# Altium schematic sheet S7CAS-PLEIADES-CARTE-MERE_P07_USB.SchDoc
size Tabloid; DocumentNumber: 12; SheetNumber: 12; SheetTotal: 16; Sheet_Name: USB; Size: 11x17
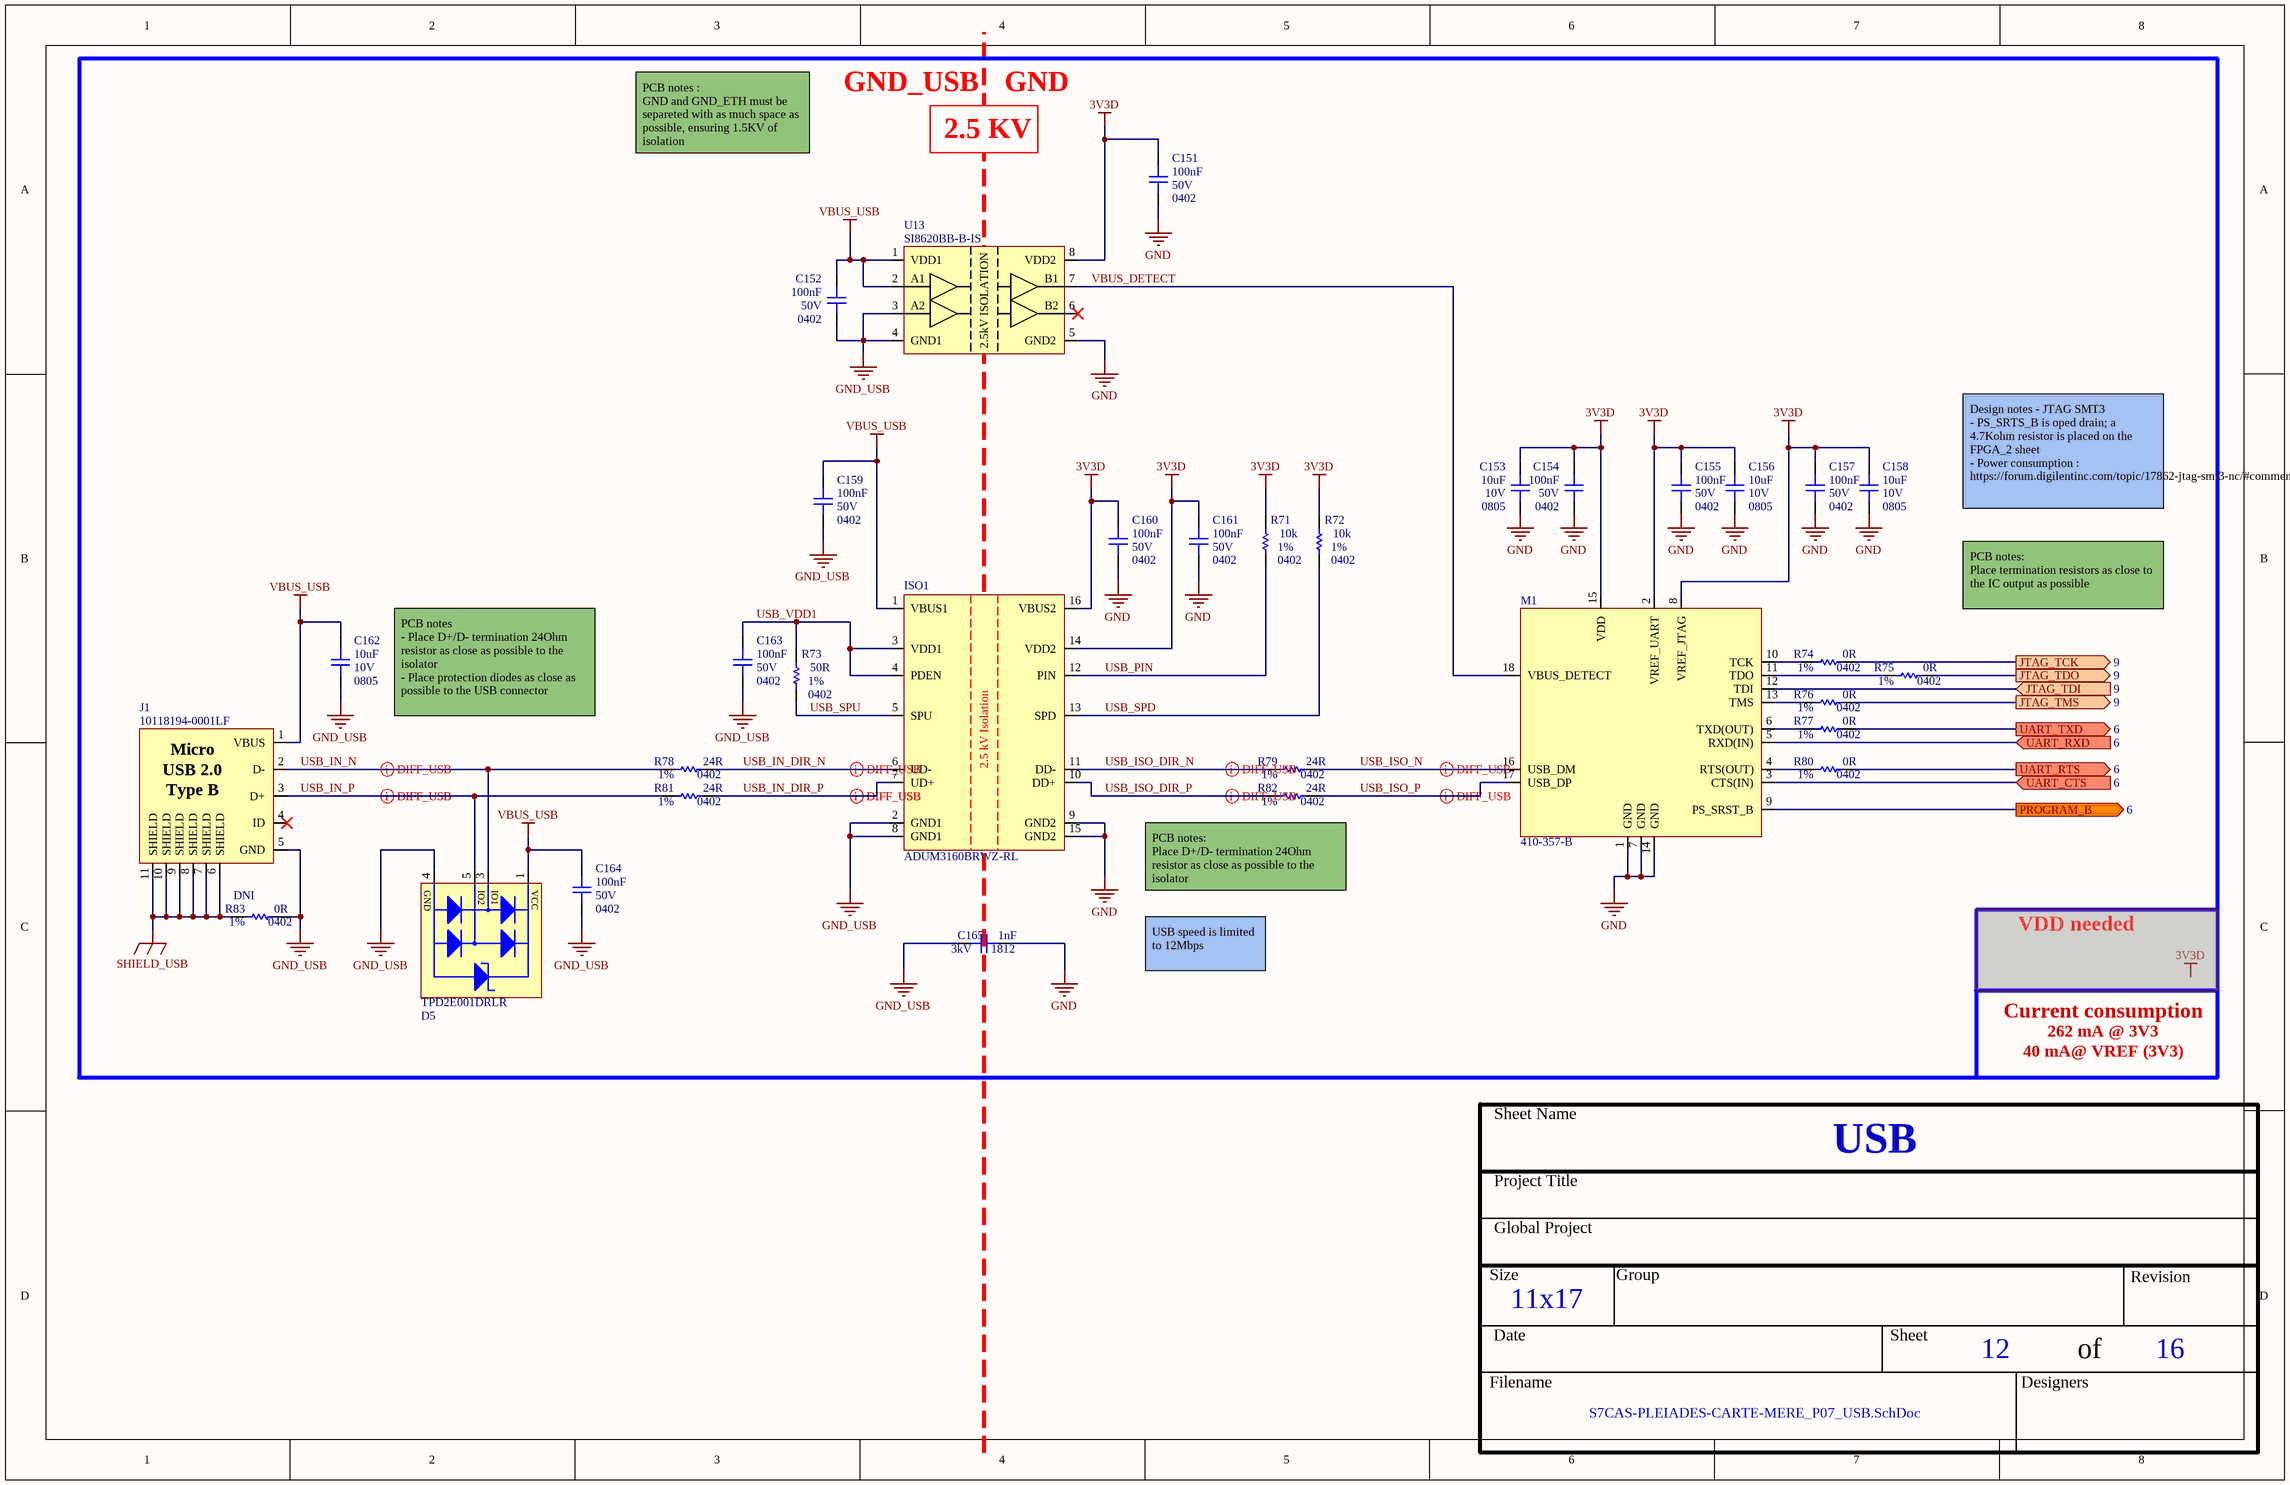
[diagram p0: S7CAS-PLEIADES-CARTE-MERE_P07_USB.SchDoc]

## Parts
C151  value 100nF  Voltage: 50V  Package: 0402  [CAP_0402]  (hidden comment: CAP - 0402)
C152  value 100nF  Voltage: 50V  Package: 0402  [CAP_0402]  (hidden comment: CAP - 0402)
C153  value 10uF  Voltage: 10V  Package: 0805  [CAP_0805]  (hidden comment: CAP - 0805)
C154  value 100nF  Voltage: 50V  Package: 0402  [CAP_0402]  (hidden comment: CAP - 0402)
C155  value 100nF  Voltage: 50V  Package: 0402  [CAP_0402]  (hidden comment: CAP - 0402)
C156  value 10uF  Voltage: 10V  Package: 0805  [CAP_0805]  (hidden comment: CAP - 0805)
C157  value 100nF  Voltage: 50V  Package: 0402  [CAP_0402]  (hidden comment: CAP - 0402)
C158  value 10uF  Voltage: 10V  Package: 0805  [CAP_0805]  (hidden comment: CAP - 0805)
C159  value 100nF  Voltage: 50V  Package: 0402  [CAP_0402]  (hidden comment: CAP - 0402)
C160  value 100nF  Voltage: 50V  Package: 0402  [CAP_0402]  (hidden comment: CAP - 0402)
C161  value 100nF  Voltage: 50V  Package: 0402  [CAP_0402]  (hidden comment: CAP - 0402)
C162  value 10uF  Voltage: 10V  Package: 0805  [CAP_0805]  (hidden comment: CAP - 0805)
C163  value 100nF  Voltage: 50V  Package: 0402  [CAP_0402]  (hidden comment: CAP - 0402)
C164  value 100nF  Voltage: 50V  Package: 0402  [CAP_0402]  (hidden comment: CAP - 0402)
C165  value 1nF  Voltage: 3kV  Package: 1812  [CAP_1812]  (hidden comment: CAP - 1812)
D5  TPD2E001DRLR  [TVS_USB_TPD2E001DRLR]
ISO1  ADUM3160BRWZ-RL  [ISO_ADUM3160BRWZ-RL]
J1  10118194-0001LF  [CON_USB_10118194-0001LF]
M1  410-357-B  [MOD_JTAG_410-357-B]
R71  value 10k  Package: 0402  Precision: 1%  [RES_0402]  (hidden comment: RES - 0402)
R72  value 10k  Package: 0402  Precision: 1%  [RES_0402]  (hidden comment: RES - 0402)
R73  value 50R  Package: 0402  Precision: 1%  [RES_0402]  (hidden comment: RES - 0402)
R74  value 0R  Package: 0402  Precision: 1%  [RES_0402]  (hidden comment: RES - 0402)
R75  value 0R  Package: 0402  Precision: 1%  [RES_0402]  (hidden comment: RES - 0402)
R76  value 0R  Package: 0402  Precision: 1%  [RES_0402]  (hidden comment: RES - 0402)
R77  value 0R  Package: 0402  Precision: 1%  [RES_0402]  (hidden comment: RES - 0402)
R78  value 24R  Package: 0402  Precision: 1%  [RES_0402]  (hidden comment: RES - 0402)
R79  value 24R  Package: 0402  Precision: 1%  [RES_0402]  (hidden comment: RES - 0402)
R80  value 0R  Package: 0402  Precision: 1%  [RES_0402]  (hidden comment: RES - 0402)
R81  value 24R  Package: 0402  Precision: 1%  [RES_0402]  (hidden comment: RES - 0402)
R82  value 24R  Package: 0402  Precision: 1%  [RES_0402]  (hidden comment: RES - 0402)
R83  value 0R  Package: 0402  Precision: 1%  Assembly note: DNI  [RES_0402]  (hidden comment: RES - 0402)
U13  SI8620BB-B-IS  [ISO_SI8620BB-B-IS]

## Ports
JTAG_TCK (out, see 9), JTAG_TDI (in, see 9), JTAG_TDO (out, see 9), JTAG_TMS (out, see 9), PROGRAM_B (out, see 6), UART_CTS (in, see 6), UART_RTS (out, see 6), UART_RXD (in, see 6), UART_TXD (out, see 6)

## Nets
3V3D: C151.2 C153.2 C154.2 C155.2 C156.2 C157.2 C158.2 C160.2 C161.2 ISO1.14(VDD2) ISO1.16(VBUS2) M1.2(VREF_UART) M1.8(VREF_JTAG) M1.15(VDD) R71.2 R72.2 U13.8(VDD2)
GND: C151.1 C153.1 C154.1 C155.1 C156.1 C157.1 C158.1 C160.1 C161.1 C165.1 ISO1.9(GND2) ISO1.15(GND2) M1.1(GND) M1.7(GND) M1.14(GND) U13.5(GND2)
GND_USB: C152.1 C159.1 C162.1 C163.1 C164.1 C165.2 D5.4(GND) ISO1.2(GND1) ISO1.8(GND1) J1.5(GND) R83.1 U13.3(A2) U13.4(GND1)
SHIELD_USB: J1.6(SHIELD) J1.7(SHIELD) J1.8(SHIELD) J1.9(SHIELD) J1.10(SHIELD) J1.11(SHIELD) R83.2
VBUS_USB: C152.2 C159.2 C162.2 C164.2 D5.1(VCC) ISO1.1(VBUS1) J1.1(VBUS) U13.1(VDD1) U13.2(A1)
JTAG_TCK: R74.1 ; port JTAG_TCK
JTAG_TDI: M1.12(TDI) ; port JTAG_TDI
JTAG_TDO: R75.1 ; port JTAG_TDO
JTAG_TMS: R76.1 ; port JTAG_TMS
PROGRAM_B: M1.9(PS_SRST_B) ; port PROGRAM_B
UART_CTS: M1.3(CTS(IN)) ; port UART_CTS
UART_RTS: R80.1 ; port UART_RTS
UART_RXD: M1.5(RXD(IN)) ; port UART_RXD
UART_TXD: R77.1 ; port UART_TXD
USB_IN_DIR_N: ISO1.6(UD-) R78.1
USB_IN_DIR_P: ISO1.7(UD+) R81.1
USB_IN_N: D5.3(IO1) J1.2(D-) R78.2
USB_IN_P: D5.5(IO2) J1.3(D+) R81.2
USB_ISO_DIR_N: ISO1.11(DD-) R79.2
USB_ISO_DIR_P: ISO1.10(DD+) R82.2
USB_ISO_N: M1.16(USB_DM) R79.1
USB_ISO_P: M1.17(USB_DP) R82.1
USB_PIN: ISO1.12(PIN) R71.1
USB_SPD: ISO1.13(SPD) R72.1
USB_SPU: ISO1.5(SPU) R73.1
USB_VDD1: C163.2 ISO1.3(VDD1) ISO1.4(PDEN) R73.2
VBUS_DETECT: M1.18(VBUS_DETECT) U13.7(B1)
NetM1_4: M1.4(RTS(OUT)) R80.2
NetM1_6: M1.6(TXD(OUT)) R77.2
NetM1_10: M1.10(TCK) R74.2
NetM1_11: M1.11(TDO) R75.2
NetM1_13: M1.13(TMS) R76.2

Not connected (* = marked no-connect by the designer): D5 2(NC); J1 4(ID)*; U13 6(B2)*

## Layout directives
differential pair; differential pair class DIFF_90OHM: USB_IN_DIR_N, USB_IN_DIR_P, USB_IN_N, USB_IN_P, USB_ISO_DIR_N, USB_ISO_DIR_P, USB_ISO_N, USB_ISO_P

## Notes on the sheet
- GND_USB
- GND
- PCB notes :
  GND and GND_ETH must be separeted with as much space as possible, ensuring 1.5KV of isolation
- 2.5 KV
- Design notes - JTAG SMT3
  - PS_SRTS_B is oped drain; a 4.7Kohm resistor is placed on the FPGA_2 sheet
  - Power consumption : https://forum.digilentinc.com/topic/17862-jtag-smt3-nc/#comment-45773
- PCB notes:
  Place termination resistors as close to the IC output as possible
- PCB notes
  - Place D+/D- termination 24Ohm resistor as close as possible to the isolator
  - Place protection diodes as close as possible to the USB connector
- (near R82) PCB notes:
  Place D+/D- termination 24Ohm resistor as close as possible to the isolator
- USB speed is limited to 12Mbps
- VDD needed
- 262 mA @ 3V3
- Current consumption
- 40 mA@ VREF (3V3)
- Sheet Name
- Project Title
- Global Project
- Size
- Group
- Revision
- Date
- Sheet
- of
- Filename
- Designers
- (in symbol CON_USB_10118194-0001LF) Micro; USB 2.0; Type B
- (in symbol ISO_ADUM3160BRWZ-RL) 2.5 kV Isolation
- (in symbol ISO_SI8620BB-B-IS) 2.5kV ISOLATION

## Library data of the parts
C151 C152 C154 C155 C157 C159-C161 C163 C164 = CAP - 0402: Precision: 10%; Current: *; CreatedBy: Jonathan Bouchard; Power: *
C153 C156 C158 C162 = CAP - 0805: Mfg: CL21B106KPQNNNE; Precision: 10%; Current: *; CreatedBy: Jonathan Bouchard; Power: *
C165 = CAP - 1812: Mfg Part Number: 1812HC102MAT1A; Precision: 10%; Current: *; CreatedBy: Jonathan Bouchard; Power: *
D5 = TVS_USB_TPD2E001DRLR: TVS - USB TVS DIODE 5.5V - SOT-553; Manufacturer #1: Texas Instruments; Value: 11V Breakdown; Voltage Rating: 5.5V (Max); GRAMS Lib Spec: 2.8; Magnetic Material: YES; Cryo: UNKNOWN; Tolerance: *; Current Rating: *; Power Max: *; HelpURL: http://www.ti.com/lit/ds/symlink/tpd2e001.pdf; CreatedBy/Date: Jonathan Bouchard 2018-07-10; VerifiedBy: Arnaud Samson 16-07-18; Temperature: -40°C ~ 85°C (TA); Package: SOT-553; Manufacturer #2: *; Note: *; Assembly Type: SMD; Part Number #2: *; Part Number #1: TPD2E001DRLR; Polarized: YES; Supplier 1: Digi-Key; Supplier Part Number 1: 296-21883-1-ND
ISO1 = ISO_ADUM3160BRWZ-RL: ISO - DGTL ISO 2.5KV 2CH USB - 16SOIC; Manufacturer #1: Analog Devices; Value: 2500Vrms voltage isolation; Voltage Rating: 3~5.5V; GRAMS Lib Spec: 2.8; Magnetic Material: UNKNOWN; Polarized: Yes; Tolerance: *; Current Rating: *; Power Max: *; HelpURL: https://www.analog.com/media/en/technical-documentation/data-sheets/ADuM3160.pdf; CreatedBy/Date: Tommy Rossignol 2018-11-16; VerifiedBy: Caroline Paulin - 13 février 2019; Temperature: -40°C ~ 105°C; Package: 16-SOIC; Manufacturer #2: *; Assembly Type: SMD; Part Number #2: *; Part Number #1: ADUM3160BRWZ-RL; Supplier 1: Digi-Key; Supplier Part Number 1: ADUM3160BRWZ-RLCT-ND; Cryo: UNKNOWN
J1 = CON_USB_10118194-0001LF: CON - USB MICRO B RECPT SMT R/A - 4PIN; Manufacturer #1: Amphenol FCI; Value: USB - Micro B; Voltage Rating: 100VAC; Current Rating: 1.8A; GRAMS Lib Spec: 2.8; Magnetic Material: YES; Cryo: UNKNOWN; Tolerance: *; Power Max: *; HelpURL: https://cdn.amphenol-icc.com/media/wysiwyg/files/drawing/10118194.pdf; CreatedBy/Date: Arnaud Samson - 09/07/18; VerifiedBy: Jonathan Bouchard 2018-07-12; Temperature: -30°C ~ 80°C; Package: 5-SMD; Manufacturer #2: *; Note: *; Assembly Type: SMD; Part Number #2: *; Part Number #1: 10118194-0001LF; Polarized: YES; Supplier 1: Digi-Key; Supplier Part Number 1: 609-4618-1-ND
M1 = MOD_JTAG_410-357-B: MOD - JTAG-SMT3-NC Programming Module For Xilinx FPGA - 18-SMT; Manufacturer #1: Digilent; Voltage Rating: VDD: 2.97V~3.63V, VJTAG/VUART: 1.65V~5.5V; GRAMS Lib Spec: 2.8; Note: Prior to reflow, the JTAG-SMT3-NC module must be dried at 125°C for 17 hours; Magnetic Material: Unknown; Polarized: Yes; Value: *; Tolerance: *; Current Rating: *; Power Max: *; HelpURL: https://reference.digilentinc.com/_media/reference/programmers/jtag-smt3/jtag-smt3-nc_rm.pdf; CreatedBy/Date: Tommy Rossignol 2018-11-23; VerifiedBy: Nicolas V. (2019-01-28); Temperature: -40°C ~ 85°C; Package: 18-pad SMT; Manufacturer #2: *; Assembly Type: SMD; Part Number #2: *; Part Number #1: 410-357-B; Supplier 1: Digi-Key; Supplier Part Number 1: 1286-1196-ND; Cryo: UNKNOWN
R71-R83 = RES - 0402: Voltage: 50V; Power: 1/16W; Current: *; CreatedBy: Jonathan Bouchard
U13 = ISO_SI8620BB-B-IS: ISO - Dual-Channel Digital Isolator (default Low) - 8-SOIC; Manufacturer #1: Silicon Labs; Voltage Rating: 2.5-5.5V; GRAMS Lib Spec: 2.8; Magnetic Material: Unknown; Polarized: Yes; Value: *; Tolerance: *; Current Rating: *; Power Max: *; HelpURL: https://www.silabs.com/documents/public/data-sheets/si861x-2x-datasheet.pdf; CreatedBy/Date: Joel Lemay 2018-06-05; VerifiedBy: Caroline Paulin - 12 sept 2018; Temperature: -40°C ~ 125°C; Package: 8-SOIC; Manufacturer #2: *; Assembly Type: SMD; Part Number #2: *; Part Number #1: SI8620BB-B-IS; Supplier 1: Digi-Key; Supplier Part Number 1: 336-2567-ND; Cryo: UNKNOWN